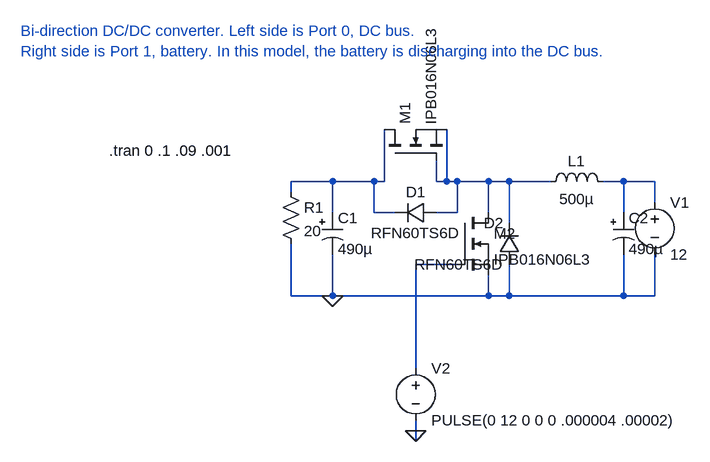
[diagram p0: schematic bi-directional-conv-dchg.asc]
bi-directional-conv-dchg.asc, the LTspice schematic file:
Version 4
SHEET 1 1336 680
WIRE 272 224 208 224
WIRE 336 224 272 224
WIRE 352 224 352 144
WIRE 352 224 336 224
WIRE 432 224 432 192
WIRE 448 224 448 144
WIRE 448 224 432 224
WIRE 464 224 448 224
WIRE 512 224 464 224
WIRE 544 224 512 224
WIRE 608 224 544 224
WIRE 720 224 688 224
WIRE 768 224 720 224
WIRE 208 240 208 224
WIRE 768 256 768 224
WIRE 272 272 272 224
WIRE 336 272 336 224
WIRE 368 272 336 272
WIRE 464 272 464 224
WIRE 464 272 432 272
WIRE 512 272 512 224
WIRE 720 272 720 224
WIRE 544 288 544 224
WIRE 464 352 400 352
WIRE 208 400 208 320
WIRE 272 400 272 336
WIRE 272 400 208 400
WIRE 512 400 512 368
WIRE 512 400 272 400
WIRE 544 400 544 352
WIRE 544 400 512 400
WIRE 720 400 720 336
WIRE 720 400 544 400
WIRE 768 400 768 336
WIRE 768 400 720 400
WIRE 400 512 400 352
WIRE 400 608 400 592
WIRE 400 624 400 608
FLAG 272 400 0
FLAG 400 608 0
SYMBOL voltage 768 240 R0
SYMATTR InstName V1
SYMATTR Value 12
SYMBOL ind 592 240 R270
WINDOW 0 32 56 VTop 2
WINDOW 3 5 56 VBottom 2
SYMATTR InstName L1
SYMATTR Value 500µ
SYMATTR SpiceLine Ipk=6.3 Rser=141.9m Rpar=61.23K Cpar=0 mfg="   ---" pn="   ---"
SYMBOL diode 432 256 R90
WINDOW 0 0 32 VBottom 2
WINDOW 3 32 32 VTop 2
SYMATTR InstName D1
SYMATTR Value RFN60TS6D
SYMBOL res 192 224 R0
SYMATTR InstName R1
SYMATTR Value 20
SYMBOL polcap 256 272 R0
WINDOW 3 24 56 Left 2
SYMATTR Value 490µ
SYMATTR InstName C1
SYMATTR Description Capacitor
SYMATTR Type cap
SYMATTR SpiceLine Rser=60m Lser=0 mfg="   ---" pn="   ---" type="   ---"
SYMBOL nmos 464 272 R0
SYMATTR InstName M2
SYMATTR Value IPB016N06L3
SYMBOL diode 560 352 R180
WINDOW 0 24 64 Left 2
WINDOW 3 24 0 Left 2
SYMATTR InstName D2
SYMATTR Value RFN60TS6D
SYMBOL voltage 400 496 R0
SYMATTR InstName V2
SYMATTR Value PULSE(0 12 0 0 0 .000004 .00002)
SYMBOL polcap 704 272 R0
WINDOW 3 24 56 Left 2
SYMATTR Value 490µ
SYMATTR InstName C2
SYMATTR Description Capacitor
SYMATTR Type cap
SYMATTR SpiceLine Rser=60m Lser=0 mfg="   ---" pn="   ---" type="   ---"
SYMBOL nmos 352 192 R270
SYMATTR InstName M1
SYMATTR Value IPB016N06L3
TEXT -72 176 Left 2 !.tran 0 .1 .09 .001
TEXT -208 -8 Left 2 ;Bi-direction DC/DC converter. Left side is Port 0, DC bus. \nRight side is Port 1, battery. In this model, the battery is discharging into the DC bus.

The netlist it stands for:
* bi-directional-conv-dchg.asc
V1 N003 0 12
L1 N002 N003 500µ Ipk=6.3 Rser=141.9m Rpar=61.23K Cpar=0 mfg="   ---" pn="   ---"
D1 N002 N001 RFN60TS6D
R1 N001 0 20
C1 N001 0 490µ Rser=60m Lser=0 mfg="   ---" pn="   ---" type="   ---"
M2 N002 N004 0 0 IPB016N06L3
D2 0 N002 RFN60TS6D
V2 N004 0 PULSE(0 12 0 0 0 .000004 .00002)
C2 N003 0 490µ Rser=60m Lser=0 mfg="   ---" pn="   ---" type="   ---"
M1 N001 N002 N002 N002 IPB016N06L3
.model D D
.lib standard.dio
.model NMOS NMOS
.model PMOS PMOS
.lib standard.mos
.tran 0 .1 .09 .001
* Bi-direction DC/DC converter. Left side is Port 0, DC bus.
* Right side is Port 1, battery. In this model, the battery is discharging into the DC bus.
.backanno
.end